# Altium schematic sheet Schematic_example.SchDoc: HDMI and DisplayPort interfaces
size A3; CompanyName: Mirko Electronics; Engineer: Peppa Pig; Address1: Smoka Wawelskiego 1; Address2: 30-535 Kraków, Poland; DocumentNumber: 10; SheetNumber: 7; SheetTotal: 20; PageSize: A3; Designators: 3xx
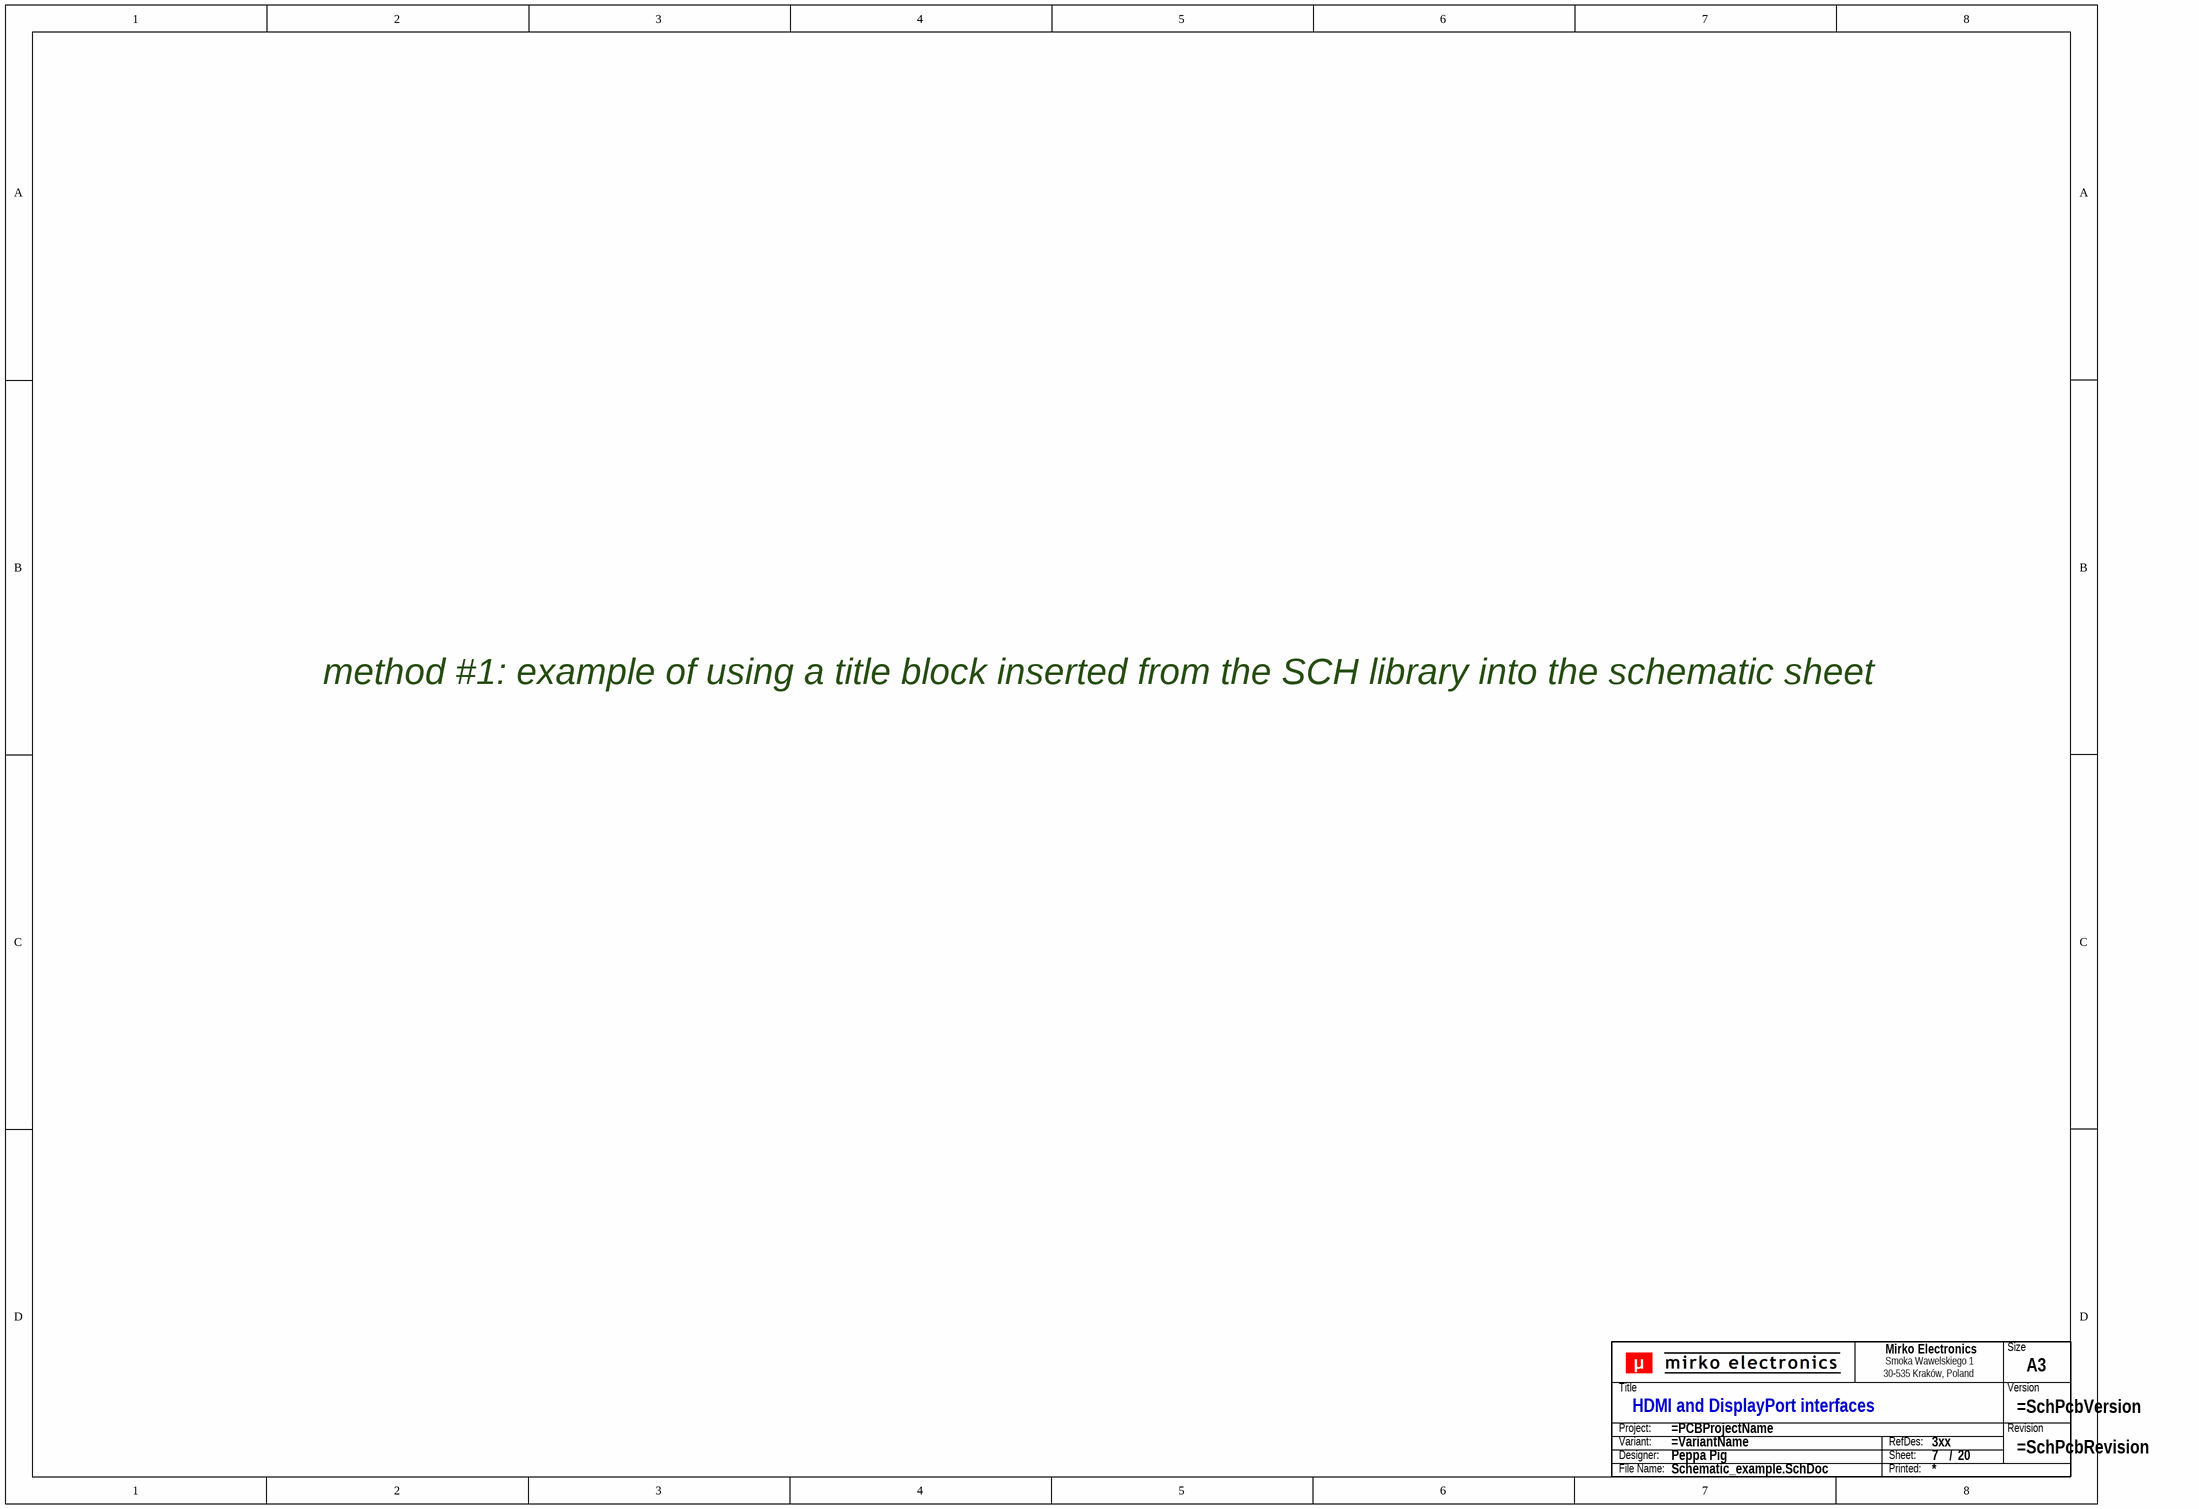
[diagram p0: Schematic_example.SchDoc]

## Parts
TB?  Title block  (value not drawn)  (graphical)

## Notes on the sheet
- method #1: example of using a title block inserted from the SCH library into the schematic sheet
- (in symbol SCH_TITLE_BLOCK_V1) Size; Title; Version; Project:; Revision; Variant:; RefDes:; Designer:; Sheet:; /; File Name:; Printed:

## Library data of the parts
TB? = SCH_TITLE_BLOCK_V1: Component Type: Title block; Manufacturer: -; Mounting Type: Non component; MPN: -; Operating Temperature: -; Package: -; Specification: Title block; Value: Title block; Replacement: -; System: ?